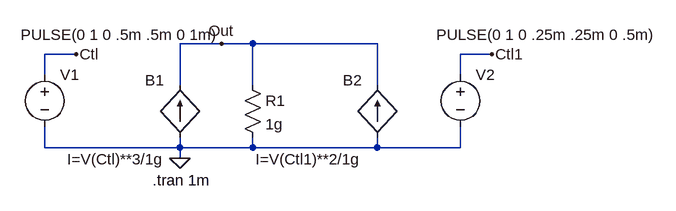
[diagram p0: schematic PolyTst.asc]
PolyTst.asc, the LTspice schematic file:
Version 4
SHEET 1 888 680
WIRE -96 224 -96 192
WIRE -96 336 -96 304
WIRE -48 192 -96 192
WIRE 112 240 112 176
WIRE 112 336 -96 336
WIRE 112 336 112 320
WIRE 112 352 112 336
WIRE 176 176 112 176
WIRE 224 176 176 176
WIRE 224 240 224 176
WIRE 224 336 112 336
WIRE 224 336 224 320
WIRE 416 176 224 176
WIRE 416 240 416 176
WIRE 416 336 224 336
WIRE 416 336 416 320
WIRE 544 224 544 192
WIRE 544 336 416 336
WIRE 544 336 544 304
WIRE 592 192 544 192
FLAG 112 352 0
FLAG 176 176 Out
FLAG -48 192 Ctl
FLAG 592 192 Ctl1
SYMBOL voltage -96 208 R0
WINDOW 3 -37 -46 Left 0
WINDOW 123 0 0 Left 0
WINDOW 39 0 0 Left 0
SYMATTR Value PULSE(0 1 0 .5m .5m 0 1m)
SYMATTR InstName V1
SYMBOL bi 112 320 R180
WINDOW 0 24 88 Left 0
WINDOW 3 26 -34 Left 0
SYMATTR InstName B1
SYMATTR Value I=V(Ctl)**3/1g
SYMBOL res 208 224 R0
SYMATTR InstName R1
SYMATTR Value 1g
SYMBOL bi 416 320 R180
WINDOW 0 24 88 Left 0
WINDOW 3 26 -34 Left 0
SYMATTR InstName B2
SYMATTR Value I=V(Ctl1)**2/1g
SYMBOL voltage 544 208 R0
WINDOW 3 -37 -46 Left 0
WINDOW 123 0 0 Left 0
WINDOW 39 0 0 Left 0
SYMATTR Value PULSE(0 1 0 .25m .25m 0 .5m)
SYMATTR InstName V2
TEXT 70 386 Left 0 !.tran 1m

The netlist it stands for:
* PolyTst.asc
V1 Ctl 0 PULSE(0 1 0 .5m .5m 0 1m)
B1 0 Out I=V(Ctl)**3/1g
R1 Out 0 1g
B2 0 Out I=V(Ctl1)**2/1g
V2 Ctl1 0 PULSE(0 1 0 .25m .25m 0 .5m)
.tran 1m
.backanno
.end